# Altium schematic sheet FPGA.SchDoc
size A1; Organization: Altium Limited; Address1: L3, 12a Rodborough Rd; Address2: Frenchs Forest; Address3: NSW; Address4: Australia 2086
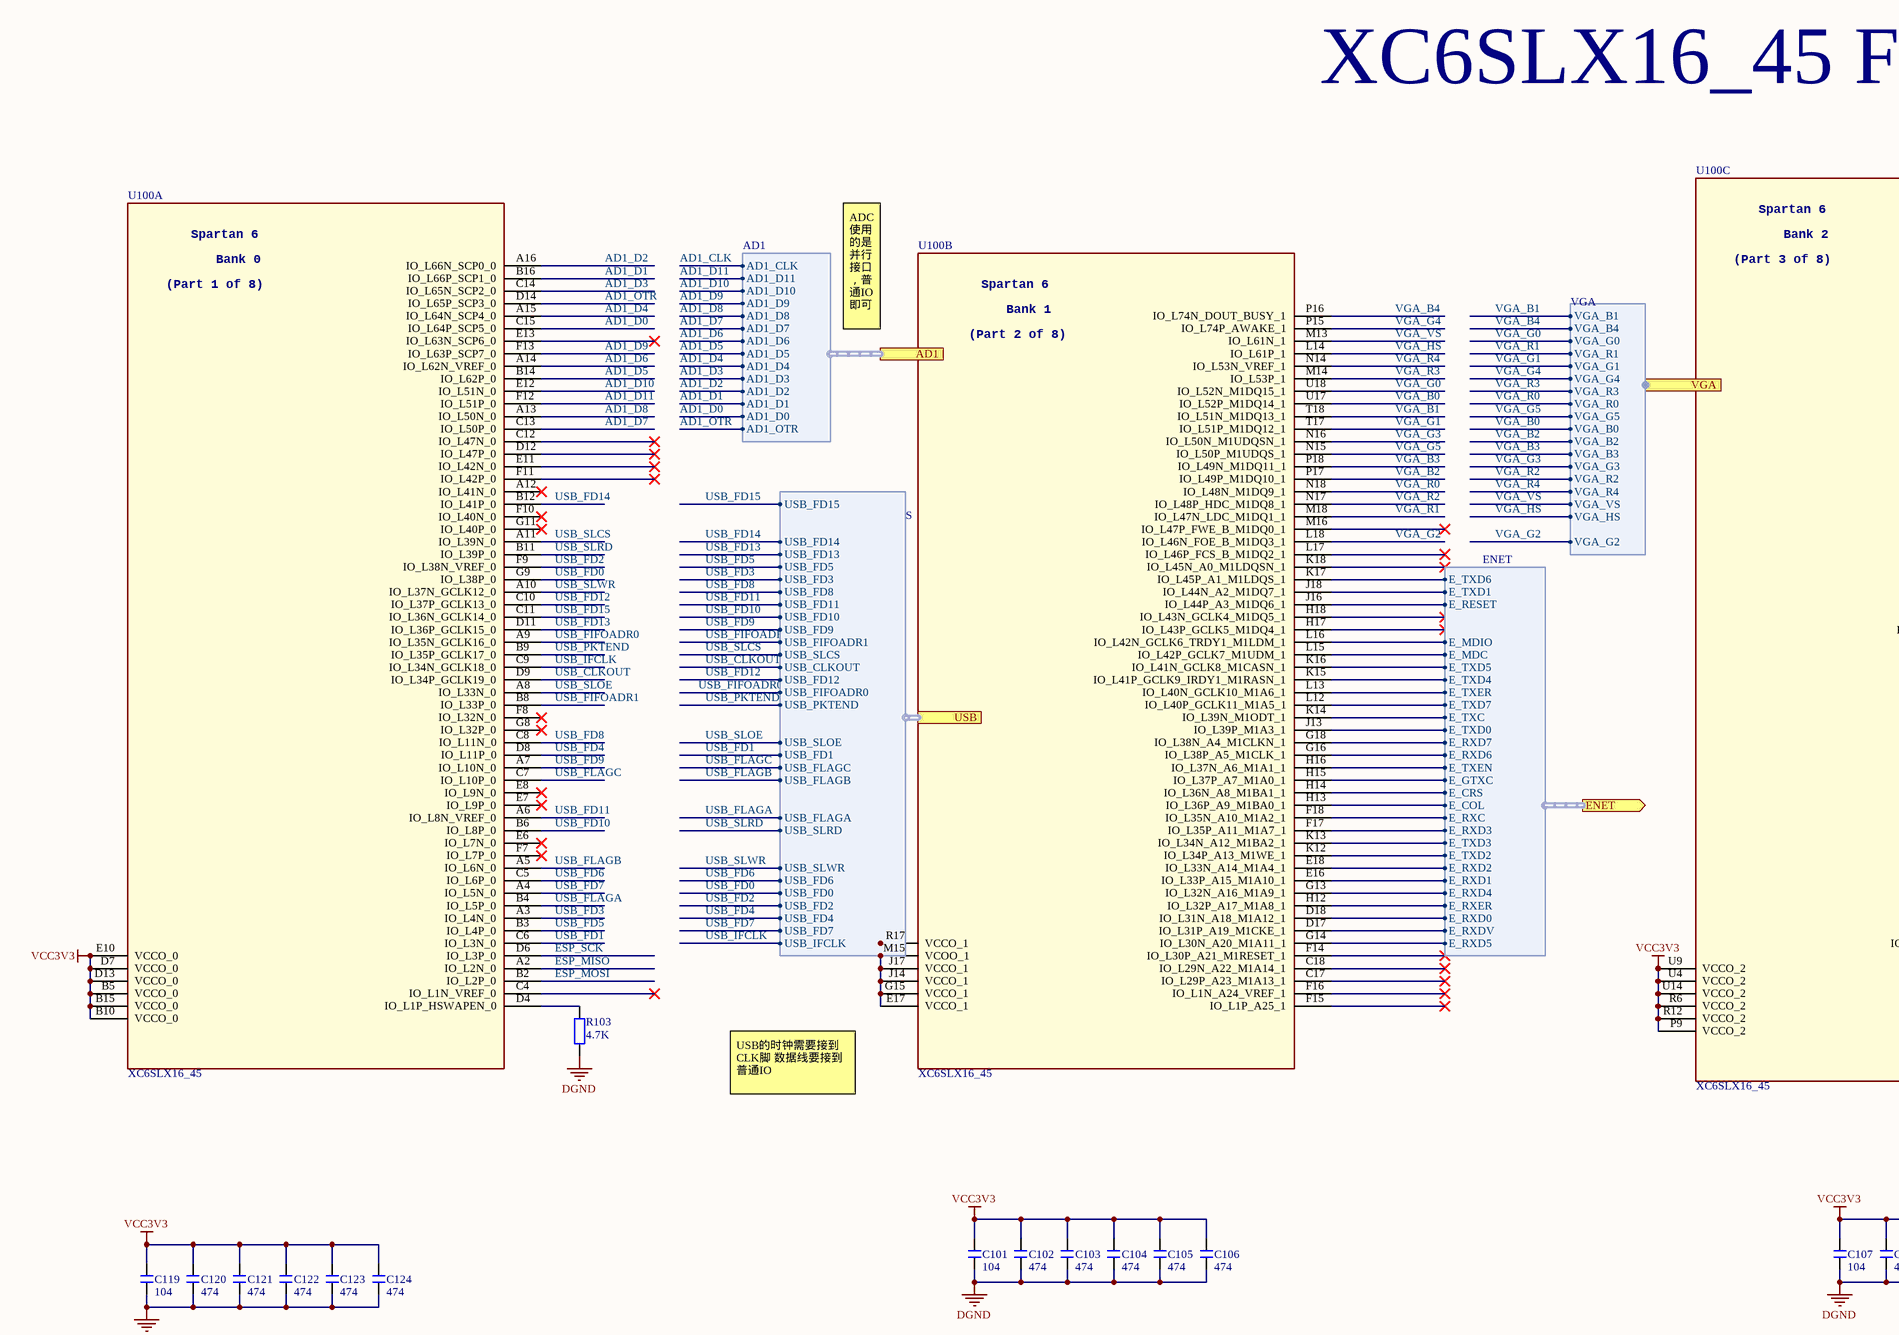
[diagram p0: FPGA.SchDoc, top left]
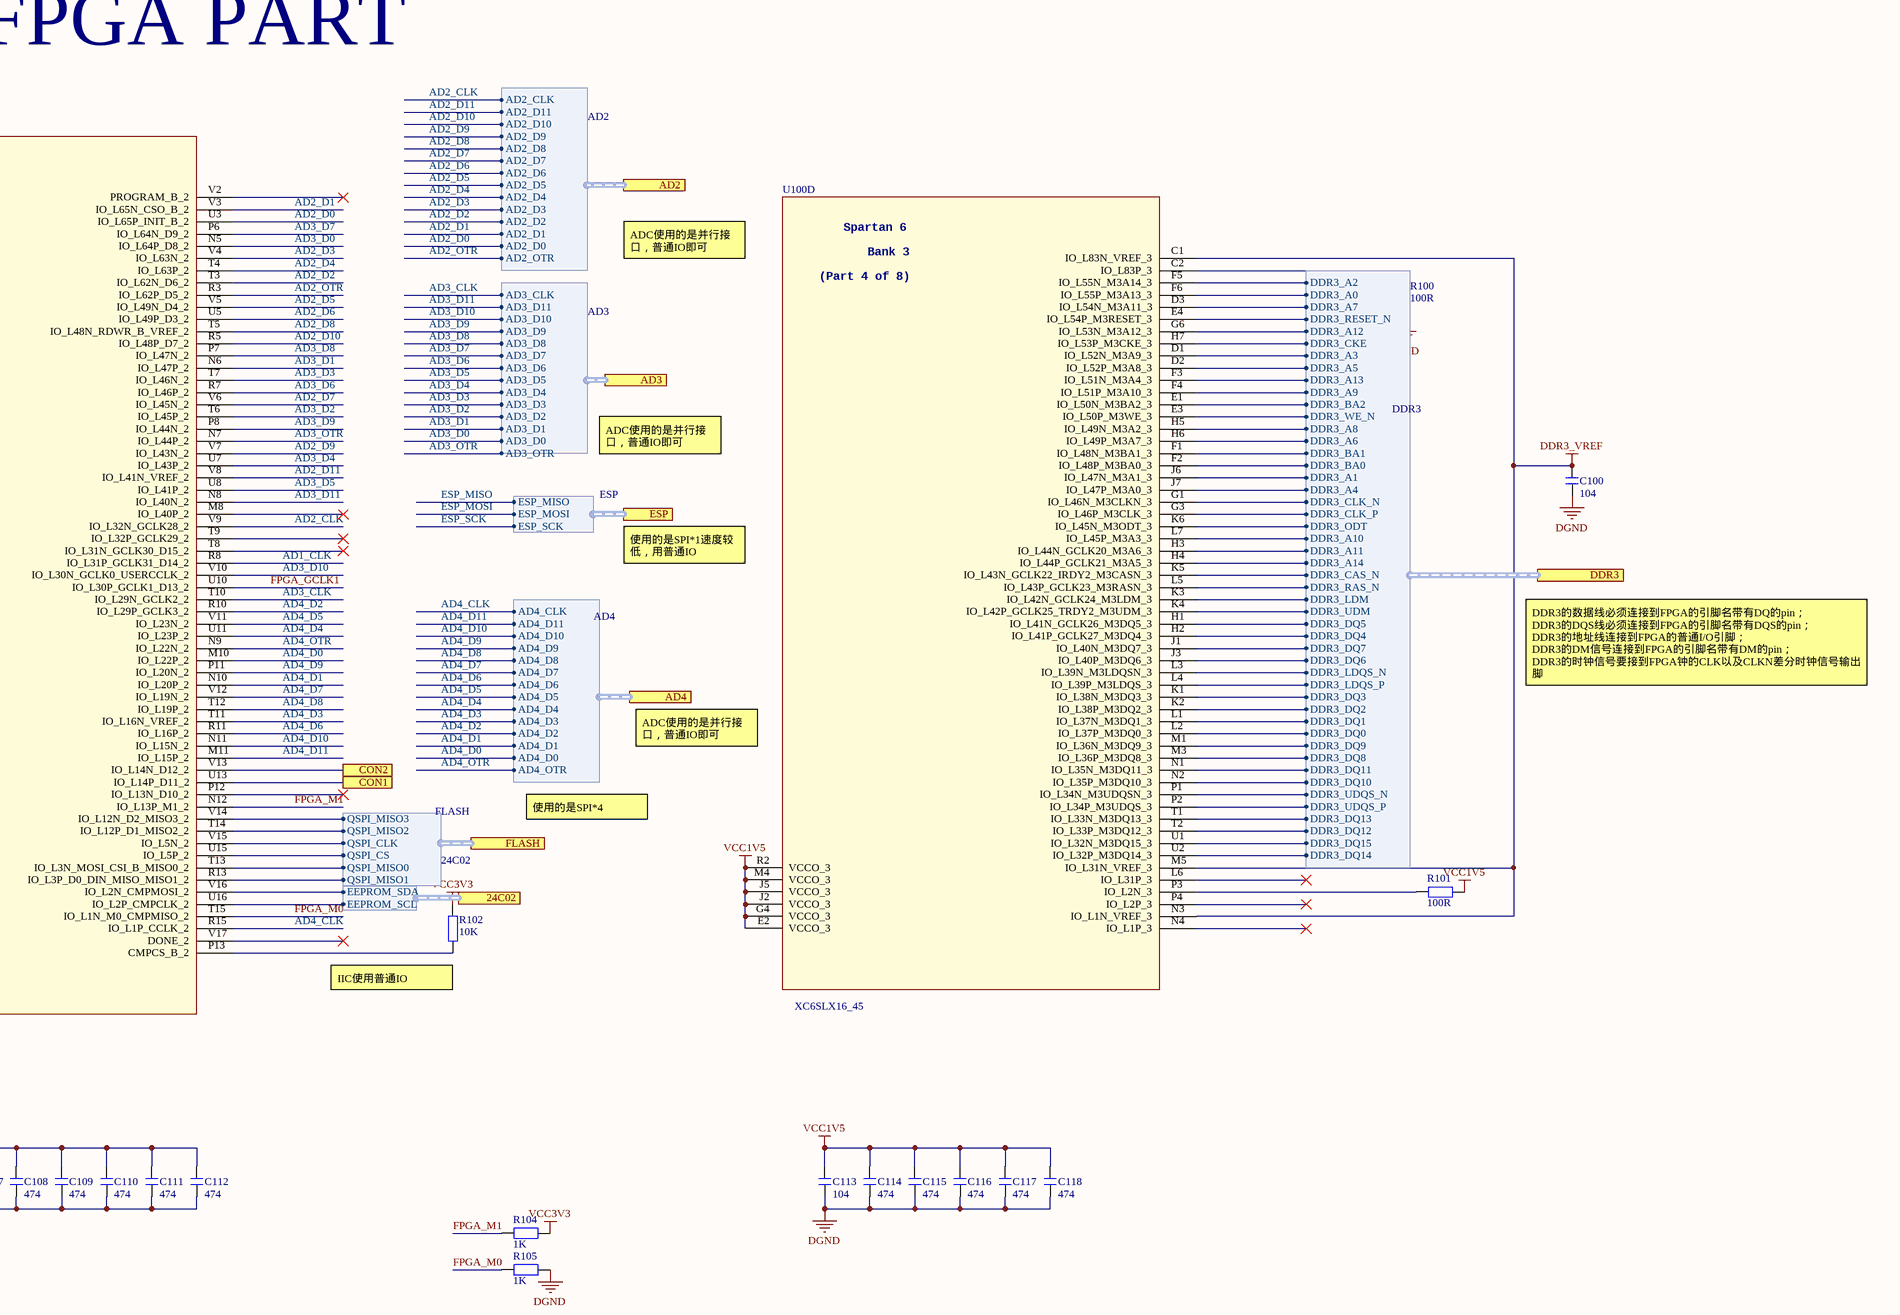
[diagram p1: FPGA.SchDoc, top right]
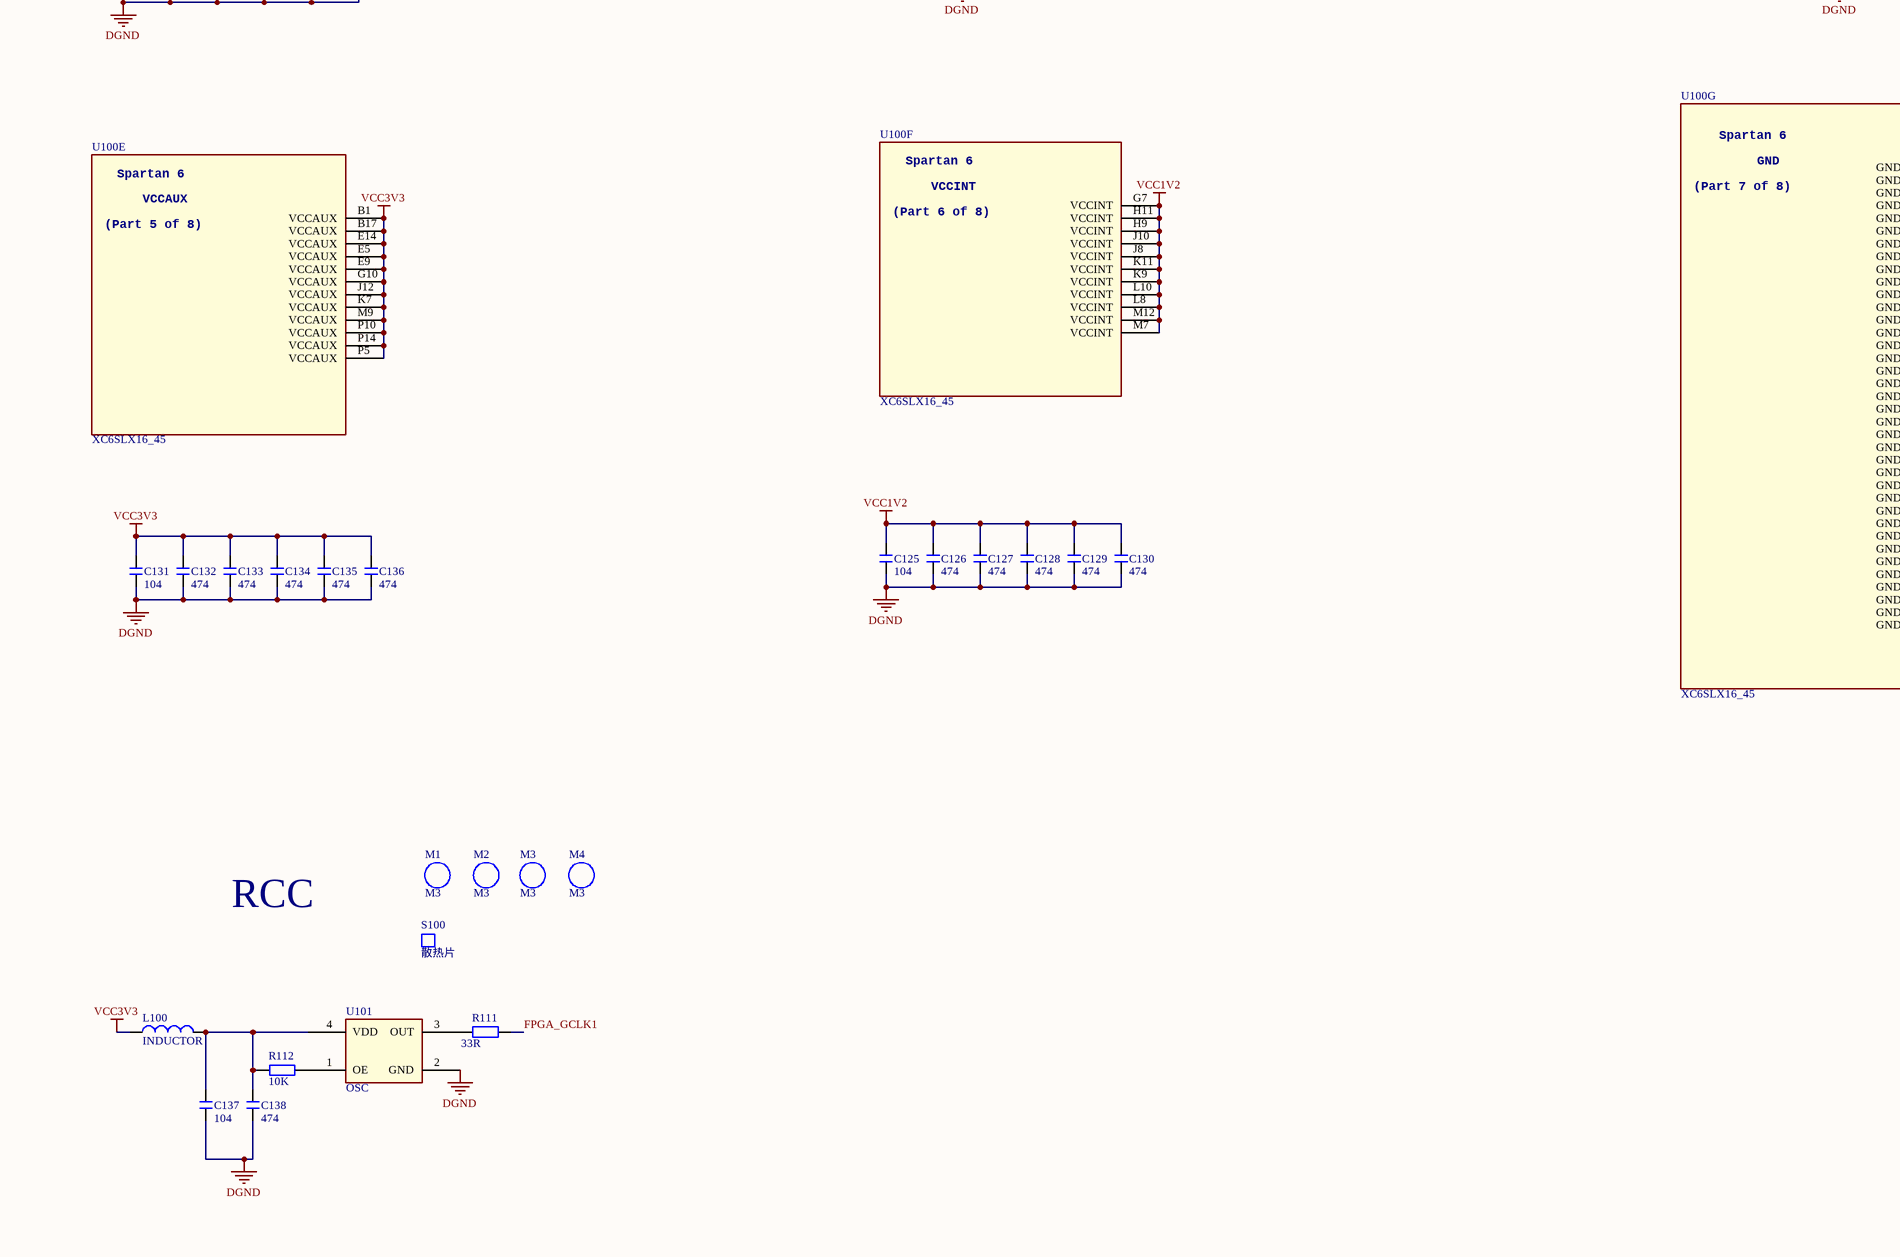
[diagram p2: FPGA.SchDoc, bottom left]
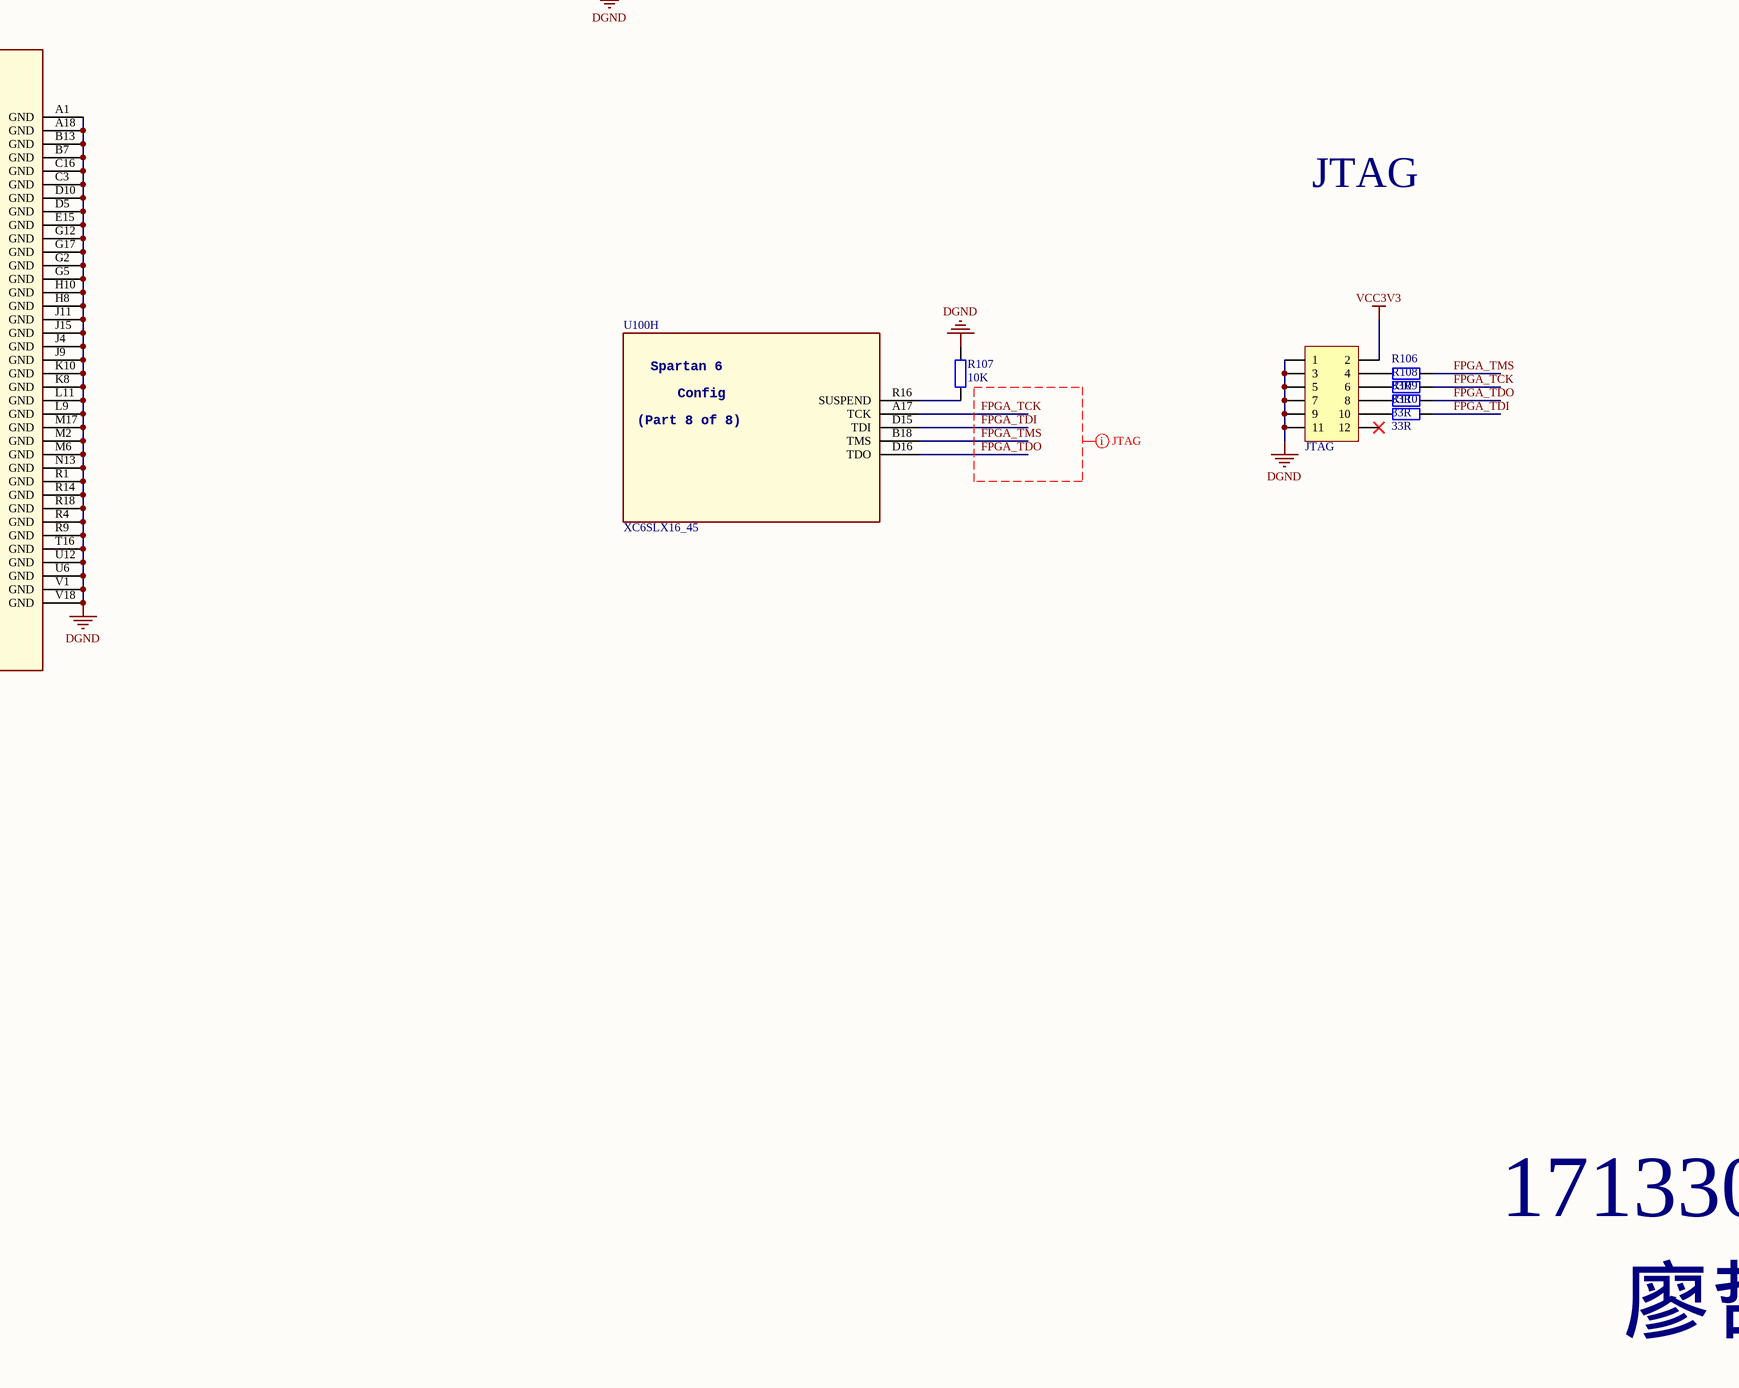
[diagram p3: FPGA.SchDoc, bottom right]

## Parts
C100  104  [C 0402_M]
C101  104  [C 0402_M]
C102  474  [C 0402_M]
C103  474  [C 0402_M]
C104  474  [C 0402_M]
C105  474  [C 0402_M]
C106  474  [C 0402_M]
C107  104  [C 0402_M]
C108  474  [C 0402_M]
C109  474  [C 0402_M]
C110  474  [C 0402_M]
C111  474  [C 0402_M]
C112  474  [C 0402_M]
C113  104  [C 0402_M]
C114  474  [C 0402_M]
C115  474  [C 0402_M]
C116  474  [C 0402_M]
C117  474  [C 0402_M]
C118  474  [C 0402_M]
C119  104  [C 0402_M]
C120  474  [C 0402_M]
C121  474  [C 0402_M]
C122  474  [C 0402_M]
C123  474  [C 0402_M]
C124  474  [C 0402_M]
C125  104  [C 0402_M]
C126  474  [C 0402_M]
C127  474  [C 0402_M]
C128  474  [C 0402_M]
C129  474  [C 0402_M]
C130  474  [C 0402_M]
C131  104  [C 0402_M]
C132  474  [C 0402_M]
C133  474  [C 0402_M]
C134  474  [C 0402_M]
C135  474  [C 0402_M]
C136  474  [C 0402_M]
C137  104  [C 0402_M]
C138  474  [C 0402_M]
JTAG  Header 6X2  [IDC2.54-LI-2x6P]  (value not drawn)
L100  INDUCTOR  [L 0805]
M1  M3  [M3 140X350]
M2  M3  [M3 140X350]
M3  M3  [M3 140X350]
M4  M3  [M3 140X350]
R100  100R  [R 0402_M]
R101  100R  [R 0402_M]
R102  10K  [R 0402_M]
R103  4.7K  [R 0402_M]
R104  1K  [R 0402_M]
R105  1K  [R 0402_M]
R106  33R  [R 0402_M]
R107  10K  [R 0402_M]
R108  33R  [R 0402_M]
R109  33R  [R 0402_M]
R110  33R  [R 0402_M]
R111  33R  [R 0402_M]
R112  10K  [R 0402_M]
S100  散热片  [SRP10-15-21]
U100  XC6SLX16_45  [BGA324C80P18X18_1500X1500X150]  (parts A,B,C,D,E,F,G,H of 8)
U101  OSC  [OSC 8045-4P]

## Ports
24C02 (harness 24C02), AD1 (harness AD1), AD2 (harness AD2), AD3 (harness AD3), AD4 (harness AD4), CON1, CON2, DDR3 (harness DDR3), ENET (out, harness ENET), ESP (harness ESP), FLASH (harness FLASH), USB (harness S), VGA (harness VGA)

## Harnesses
DDR3: DDR3_A2, DDR3_A0, DDR3_A7, DDR3_RESET_N, DDR3_A12, DDR3_CKE, DDR3_A3, DDR3_A5, DDR3_A13, DDR3_A9, DDR3_BA2, DDR3_WE_N, DDR3_A8, DDR3_A6, DDR3_BA1, DDR3_BA0, DDR3_A1, DDR3_A4, DDR3_CLK_N, DDR3_CLK_P, DDR3_ODT, DDR3_A10, DDR3_A11, DDR3_A14, DDR3_CAS_N, DDR3_RAS_N, DDR3_LDM, DDR3_UDM, DDR3_DQ5, DDR3_DQ4, DDR3_DQ7, DDR3_DQ6, DDR3_LDQS_N, DDR3_LDQS_P, DDR3_DQ3, DDR3_DQ2, DDR3_DQ1, DDR3_DQ0, DDR3_DQ9, DDR3_DQ8, DDR3_DQ11, DDR3_DQ10, DDR3_UDQS_N, DDR3_UDQS_P, DDR3_DQ13, DDR3_DQ12, DDR3_DQ15, DDR3_DQ14
ENET: E_TXD6, E_TXD1, E_RESET, E_MDIO, E_MDC, E_TXD5, E_TXD4, E_TXER, E_TXD7, E_TXC, E_TXD0, E_RXD7, E_RXD6, E_TXEN, E_GTXC, E_CRS, E_COL, E_RXC, E_RXD3, E_TXD3, E_TXD2, E_RXD2, E_RXD1, E_RXD4, E_RXER, E_RXD0, E_RXDV, E_RXD5
FLASH: QSPI_MISO3, QSPI_MISO2, QSPI_CLK, QSPI_CS, QSPI_MISO0, QSPI_MISO1
AD1: AD1_CLK, AD1_D11, AD1_D10, AD1_D9, AD1_D8, AD1_D7, AD1_D6, AD1_D5, AD1_D4, AD1_D3, AD1_D2, AD1_D1, AD1_D0, AD1_OTR
AD2: AD2_CLK, AD2_D11, AD2_D10, AD2_D9, AD2_D8, AD2_D7, AD2_D6, AD2_D5, AD2_D4, AD2_D3, AD2_D2, AD2_D1, AD2_D0, AD2_OTR
AD3: AD3_CLK, AD3_D11, AD3_D10, AD3_D9, AD3_D8, AD3_D7, AD3_D6, AD3_D5, AD3_D4, AD3_D3, AD3_D2, AD3_D1, AD3_D0, AD3_OTR
AD4: AD4_CLK, AD4_D11, AD4_D10, AD4_D9, AD4_D8, AD4_D7, AD4_D6, AD4_D5, AD4_D4, AD4_D3, AD4_D2, AD4_D1, AD4_D0, AD4_OTR
ESP: ESP_MISO, ESP_MOSI, ESP_SCK
VGA: VGA_B1, VGA_B4, VGA_G0, VGA_R1, VGA_G1, VGA_G4, VGA_R3, VGA_R0, VGA_G5, VGA_B0, VGA_G3, VGA_R2, VGA_G2, VGA_R4, VGA_VS, VGA_HS, VGA_B2, VGA_B3
S: USB_FD15, USB_FD14, USB_FD13, USB_FD5, USB_FD3, USB_FD8, USB_FD11, USB_FD10, USB_FD9, USB_FIFOADR1, USB_SLCS, USB_CLKOUT, USB_FD12, USB_FIFOADR0, USB_PKTEND, USB_SLOE, USB_FD1, USB_FLAGC, USB_FLAGB, USB_FLAGA, USB_SLRD, USB_SLWR, USB_FD6, USB_FD0, USB_FD2, USB_FD4, USB_FD7, USB_IFCLK
24C02: EEPROM_SDA, EEPROM_SCL

## Nets
DDR3_VREF: C100.2 U100.C1(IO_L83N_VREF_3) U100.M5(IO_L31N_VREF_3) U100.N3(IO_L1N_VREF_3)
DGND: C100.1 C101.1 C102.1 C103.1 C104.1 C105.1 C106.1 C107.1 C108.1 C109.1 C110.1 C111.1 C112.1 C113.1 C114.1 C115.1 C116.1 C117.1 C118.1 C119.1 C120.1 C121.1 C122.1 C123.1 C124.1 C125.1 C126.1 C127.1 C128.1 C129.1 C130.1 C131.1 C132.1 C133.1 C134.1 C135.1 C136.1 C137.1 C138.1 JTAG.1 JTAG.3 JTAG.5 JTAG.7 JTAG.9 JTAG.11 R100.1 R103.1 R105.2 R107.1 U100.A1(GND) U100.A18(GND) U100.B7(GND) U100.B13(GND) U100.C3(GND) U100.C16(GND) U100.D5(GND) U100.D10(GND) U100.E15(GND) U100.G2(GND) U100.G5(GND) U100.G12(GND) U100.G17(GND) U100.H8(GND) U100.H10(GND) U100.J4(GND) U100.J9(GND) U100.J11(GND) U100.J15(GND) U100.K8(GND) U100.K10(GND) U100.L9(GND) U100.L11(GND) U100.M2(GND) U100.M6(GND) U100.M17(GND) U100.N13(GND) U100.R1(GND) U100.R4(GND) U100.R9(GND) U100.R14(GND) U100.R18(GND) U100.T16(GND) U100.U6(GND) U100.U12(GND) U100.V1(GND) U100.V18(GND) U101.2(GND)
VCC1V2: C125.2 C126.2 C127.2 C128.2 C129.2 C130.2 U100.G7(VCCINT) U100.H9(VCCINT) U100.H11(VCCINT) U100.J8(VCCINT) U100.J10(VCCINT) U100.K9(VCCINT) U100.K11(VCCINT) U100.L8(VCCINT) U100.L10(VCCINT) U100.M7(VCCINT) U100.M12(VCCINT)
VCC1V5: C113.2 C114.2 C115.2 C116.2 C117.2 C118.2 R101.1 U100.E2(VCCO_3) U100.G4(VCCO_3) U100.J2(VCCO_3) U100.J5(VCCO_3) U100.M4(VCCO_3) U100.R2(VCCO_3)
VCC3V3: C101.2 C102.2 C103.2 C104.2 C105.2 C106.2 C107.2 C108.2 C109.2 C110.2 C111.2 C112.2 C119.2 C120.2 C121.2 C122.2 C123.2 C124.2 C131.2 C132.2 C133.2 C134.2 C135.2 C136.2 JTAG.2 L100.1 R102.1 R104.2 U100.B1(VCCAUX) U100.B5(VCCO_0) U100.B10(VCCO_0) U100.B15(VCCO_0) U100.B17(VCCAUX) U100.D7(VCCO_0) U100.D13(VCCO_0) U100.E5(VCCAUX) U100.E9(VCCAUX) U100.E10(VCCO_0) U100.E14(VCCAUX) U100.E17(VCCO_1) U100.G10(VCCAUX) U100.G15(VCCO_1) U100.J12(VCCAUX) U100.J14(VCCO_1) U100.J17(VCCO_1) U100.K7(VCCAUX) U100.M9(VCCAUX) U100.M15(VCOO_1) U100.P5(VCCAUX) U100.P9(VCCO_2) U100.P10(VCCAUX) U100.P14(VCCAUX) U100.R6(VCCO_2) U100.R12(VCCO_2) U100.R17(VCCO_1) U100.U4(VCCO_2) U100.U9(VCCO_2) U100.U14(VCCO_2)
AD1_CLK: U100.R8(IO_L31P_GCLK31_D14_2) ; port AD1.AD1_CLK
AD1_D0: U100.C15(IO_L64P_SCP5_0) ; port AD1.AD1_D0
AD1_D1: U100.B16(IO_L66P_SCP1_0) ; port AD1.AD1_D1
AD1_D2: U100.A16(IO_L66N_SCP0_0) ; port AD1.AD1_D2
AD1_D3: U100.C14(IO_L65N_SCP2_0) ; port AD1.AD1_D3
AD1_D4: U100.A15(IO_L64N_SCP4_0) ; port AD1.AD1_D4
AD1_D5: U100.B14(IO_L62P_0) ; port AD1.AD1_D5
AD1_D6: U100.A14(IO_L62N_VREF_0) ; port AD1.AD1_D6
AD1_D7: U100.C13(IO_L50P_0) ; port AD1.AD1_D7
AD1_D8: U100.A13(IO_L50N_0) ; port AD1.AD1_D8
AD1_D9: U100.F13(IO_L63P_SCP7_0) ; port AD1.AD1_D9
AD1_D10: U100.E12(IO_L51N_0) ; port AD1.AD1_D10
AD1_D11: U100.F12(IO_L51P_0) ; port AD1.AD1_D11
AD1_OTR: U100.D14(IO_L65P_SCP3_0) ; port AD1.AD1_OTR
AD2_CLK: U100.V9(IO_L32N_GCLK28_2) ; port AD2.AD2_CLK
AD2_D0: U100.U3(IO_L65P_INIT_B_2) ; port AD2.AD2_D0
AD2_D1: U100.V3(IO_L65N_CSO_B_2) ; port AD2.AD2_D1
AD2_D2: U100.T3(IO_L62N_D6_2) ; port AD2.AD2_D2
AD2_D3: U100.V4(IO_L63N_2) ; port AD2.AD2_D3
AD2_D4: U100.T4(IO_L63P_2) ; port AD2.AD2_D4
AD2_D5: U100.V5(IO_L49N_D4_2) ; port AD2.AD2_D5
AD2_D6: U100.U5(IO_L49P_D3_2) ; port AD2.AD2_D6
AD2_D7: U100.V6(IO_L45N_2) ; port AD2.AD2_D7
AD2_D8: U100.T5(IO_L48N_RDWR_B_VREF_2) ; port AD2.AD2_D8
AD2_D9: U100.V7(IO_L43N_2) ; port AD2.AD2_D9
AD2_D10: U100.R5(IO_L48P_D7_2) ; port AD2.AD2_D10
AD2_D11: U100.V8(IO_L41N_VREF_2) ; port AD2.AD2_D11
AD2_OTR: U100.R3(IO_L62P_D5_2) ; port AD2.AD2_OTR
AD3_CLK: U100.T10(IO_L29N_GCLK2_2) ; port AD3.AD3_CLK
AD3_D0: U100.N5(IO_L64P_D8_2) ; port AD3.AD3_D0
AD3_D1: U100.N6(IO_L47P_2) ; port AD3.AD3_D1
AD3_D2: U100.T6(IO_L45P_2) ; port AD3.AD3_D2
AD3_D3: U100.T7(IO_L46N_2) ; port AD3.AD3_D3
AD3_D4: U100.U7(IO_L43P_2) ; port AD3.AD3_D4
AD3_D5: U100.U8(IO_L41P_2) ; port AD3.AD3_D5
AD3_D6: U100.R7(IO_L46P_2) ; port AD3.AD3_D6
AD3_D7: U100.P6(IO_L64N_D9_2) ; port AD3.AD3_D7
AD3_D8: U100.P7(IO_L47N_2) ; port AD3.AD3_D8
AD3_D9: U100.P8(IO_L44N_2) ; port AD3.AD3_D9
AD3_D10: U100.V10(IO_L30N_GCLK0_USERCCLK_2) ; port AD3.AD3_D10
AD3_D11: U100.N8(IO_L40N_2) ; port AD3.AD3_D11
AD3_OTR: U100.N7(IO_L44P_2) ; port AD3.AD3_OTR
AD4_CLK: U100.R15(IO_L1P_CCLK_2) ; port AD4.AD4_CLK
AD4_D0: U100.M10(IO_L22P_2) ; port AD4.AD4_D0
AD4_D1: U100.N10(IO_L20P_2) ; port AD4.AD4_D1
AD4_D2: U100.R10(IO_L29P_GCLK3_2) ; port AD4.AD4_D2
AD4_D3: U100.T11(IO_L16N_VREF_2) ; port AD4.AD4_D3
AD4_D4: U100.U11(IO_L23P_2) ; port AD4.AD4_D4
AD4_D5: U100.V11(IO_L23N_2) ; port AD4.AD4_D5
AD4_D6: U100.R11(IO_L16P_2) ; port AD4.AD4_D6
AD4_D7: U100.V12(IO_L19N_2) ; port AD4.AD4_D7
AD4_D8: U100.T12(IO_L19P_2) ; port AD4.AD4_D8
AD4_D9: U100.P11(IO_L20N_2) ; port AD4.AD4_D9
AD4_D10: U100.N11(IO_L15N_2) ; port AD4.AD4_D10
AD4_D11: U100.M11(IO_L15P_2) ; port AD4.AD4_D11
AD4_OTR: U100.N9(IO_L22N_2) ; port AD4.AD4_OTR
CON1: U100.U13(IO_L14P_D11_2) ; port CON1
CON2: U100.V13(IO_L14N_D12_2) ; port CON2
ESP_MISO: U100.A2(IO_L2N_0) ; port ESP.ESP_MISO
ESP_MOSI: U100.B2(IO_L2P_0) ; port ESP.ESP_MOSI
ESP_SCK: U100.D6(IO_L3P_0) ; port ESP.ESP_SCK
FPGA_GCLK1: R111.2 U100.U10(IO_L30P_GCLK1_D13_2)
FPGA_M0: R105.1 U100.T15(IO_L1N_M0_CMPMISO_2)
FPGA_M1: R104.1 U100.N12(IO_L13P_M1_2)
FPGA_TCK: R108.2 U100.A17(TCK)
FPGA_TDI: R110.2 U100.D15(TDI)
FPGA_TDO: R109.2 U100.D16(TDO)
FPGA_TMS: R106.2 U100.B18(TMS)
USB_CLKOUT: U100.D9(IO_L34P_GCLK19_0) ; port USB.USB_CLKOUT
USB_FD0: U100.G9(IO_L38P_0) ; port USB.USB_FD0
USB_FD1: U100.C6(IO_L3N_0) ; port USB.USB_FD1
USB_FD2: U100.F9(IO_L38N_VREF_0) ; port USB.USB_FD2
USB_FD3: U100.A3(IO_L4N_0) ; port USB.USB_FD3
USB_FD4: U100.D8(IO_L11P_0) ; port USB.USB_FD4
USB_FD5: U100.B3(IO_L4P_0) ; port USB.USB_FD5
USB_FD6: U100.C5(IO_L6P_0) ; port USB.USB_FD6
USB_FD7: U100.A4(IO_L5N_0) ; port USB.USB_FD7
USB_FD8: U100.C8(IO_L11N_0) ; port USB.USB_FD8
USB_FD9: U100.A7(IO_L10N_0) ; port USB.USB_FD9
USB_FD10: U100.B6(IO_L8P_0) ; port USB.USB_FD10
USB_FD11: U100.A6(IO_L8N_VREF_0) ; port USB.USB_FD11
USB_FD12: U100.C10(IO_L37P_GCLK13_0) ; port USB.USB_FD12
USB_FD13: U100.D11(IO_L36P_GCLK15_0) ; port USB.USB_FD13
USB_FD14: U100.B12(IO_L41P_0) ; port USB.USB_FD14
USB_FD15: U100.C11(IO_L36N_GCLK14_0) ; port USB.USB_FD15
USB_FIFOADR0: U100.A9(IO_L35N_GCLK16_0) ; port USB.USB_FIFOADR0
USB_FIFOADR1: U100.B8(IO_L33P_0) ; port USB.USB_FIFOADR1
USB_FLAGA: U100.B4(IO_L5P_0) ; port USB.USB_FLAGA
USB_FLAGB: U100.A5(IO_L6N_0) ; port USB.USB_FLAGB
USB_FLAGC: U100.C7(IO_L10P_0) ; port USB.USB_FLAGC
USB_IFCLK: U100.C9(IO_L34N_GCLK18_0) ; port USB.USB_IFCLK
USB_PKTEND: U100.B9(IO_L35P_GCLK17_0) ; port USB.USB_PKTEND
USB_SLCS: U100.A11(IO_L39N_0) ; port USB.USB_SLCS
USB_SLOE: U100.A8(IO_L33N_0) ; port USB.USB_SLOE
USB_SLRD: U100.B11(IO_L39P_0) ; port USB.USB_SLRD
USB_SLWR: U100.A10(IO_L37N_GCLK12_0) ; port USB.USB_SLWR
VGA_B0: U100.U17(IO_L52P_M1DQ14_1) ; port VGA.VGA_B0
VGA_B1: U100.T18(IO_L51N_M1DQ13_1) ; port VGA.VGA_B1
VGA_B2: U100.P17(IO_L49P_M1DQ10_1) ; port VGA.VGA_B2
VGA_B3: U100.P18(IO_L49N_M1DQ11_1) ; port VGA.VGA_B3
VGA_B4: U100.P16(IO_L74N_DOUT_BUSY_1) ; port VGA.VGA_B4
VGA_G0: U100.U18(IO_L52N_M1DQ15_1) ; port VGA.VGA_G0
VGA_G1: U100.T17(IO_L51P_M1DQ12_1) ; port VGA.VGA_G1
VGA_G2: U100.L18(IO_L46N_FOE_B_M1DQ3_1) ; port VGA.VGA_G2
VGA_G3: U100.N16(IO_L50N_M1UDQSN_1) ; port VGA.VGA_G3
VGA_G4: U100.P15(IO_L74P_AWAKE_1) ; port VGA.VGA_G4
VGA_G5: U100.N15(IO_L50P_M1UDQS_1) ; port VGA.VGA_G5
VGA_HS: U100.L14(IO_L61P_1) ; port VGA.VGA_HS
VGA_R0: U100.N18(IO_L48N_M1DQ9_1) ; port VGA.VGA_R0
VGA_R1: U100.M18(IO_L47N_LDC_M1DQ1_1) ; port VGA.VGA_R1
VGA_R2: U100.N17(IO_L48P_HDC_M1DQ8_1) ; port VGA.VGA_R2
VGA_R3: U100.M14(IO_L53P_1) ; port VGA.VGA_R3
VGA_R4: U100.N14(IO_L53N_VREF_1) ; port VGA.VGA_R4
VGA_VS: U100.M13(IO_L61N_1) ; port VGA.VGA_VS
NetC137_2: C137.2 C138.2 L100.2 R112.1 U101.4(VDD)
NetJTAG_4: JTAG.4 R106.1
NetJTAG_6: JTAG.6 R108.1
NetJTAG_8: JTAG.8 R109.1
NetJTAG_10: JTAG.10 R110.1
NetR100_2: R100.2 U100.C2(IO_L83P_3)
NetR101_2: R101.2 U100.P3(IO_L2N_3)
NetR102_2: R102.2 U100.P13(CMPCS_B_2)
NetR103_2: R103.2 U100.D4(IO_L1P_HSWAPEN_0)
NetR107_2: R107.2 U100.R16(SUSPEND)
NetR111_1: R111.1 U101.3(OUT)
NetR112_2: R112.2 U101.1(OE)
NetU100_D1: U100.D1(IO_L52N_M3A9_3) ; port DDR3.DDR3_A3
NetU100_D2: U100.D2(IO_L52P_M3A8_3) ; port DDR3.DDR3_A5
NetU100_D3: U100.D3(IO_L54N_M3A11_3) ; port DDR3.DDR3_A7
NetU100_D17: U100.D17(IO_L31P_A19_M1CKE_1) ; port ENET.E_RXDV
NetU100_D18: U100.D18(IO_L31N_A18_M1A12_1) ; port ENET.E_RXD0
NetU100_E1: U100.E1(IO_L50N_M3BA2_3) ; port DDR3.DDR3_BA2
NetU100_E3: U100.E3(IO_L50P_M3WE_3) ; port DDR3.DDR3_WE_N
NetU100_E4: U100.E4(IO_L54P_M3RESET_3) ; port DDR3.DDR3_RESET_N
NetU100_E16: U100.E16(IO_L33P_A15_M1A10_1) ; port ENET.E_RXD1
NetU100_E18: U100.E18(IO_L33N_A14_M1A4_1) ; port ENET.E_RXD2
NetU100_F1: U100.F1(IO_L48N_M3BA1_3) ; port DDR3.DDR3_BA1
NetU100_F2: U100.F2(IO_L48P_M3BA0_3) ; port DDR3.DDR3_BA0
NetU100_F3: U100.F3(IO_L51N_M3A4_3) ; port DDR3.DDR3_A13
NetU100_F4: U100.F4(IO_L51P_M3A10_3) ; port DDR3.DDR3_A9
NetU100_F5: U100.F5(IO_L55N_M3A14_3) ; port DDR3.DDR3_A2
NetU100_F6: U100.F6(IO_L55P_M3A13_3) ; port DDR3.DDR3_A0
NetU100_F17: U100.F17(IO_L35P_A11_M1A7_1) ; port ENET.E_RXD3
NetU100_F18: U100.F18(IO_L35N_A10_M1A2_1) ; port ENET.E_RXC
NetU100_G1: U100.G1(IO_L46N_M3CLKN_3) ; port DDR3.DDR3_CLK_N
NetU100_G3: U100.G3(IO_L46P_M3CLK_3) ; port DDR3.DDR3_CLK_P
NetU100_G6: U100.G6(IO_L53N_M3A12_3) ; port DDR3.DDR3_A12
NetU100_G13: U100.G13(IO_L32N_A16_M1A9_1) ; port ENET.E_RXD4
NetU100_G14: U100.G14(IO_L30N_A20_M1A11_1) ; port ENET.E_RXD5
NetU100_G16: U100.G16(IO_L38P_A5_M1CLK_1) ; port ENET.E_RXD6
NetU100_G18: U100.G18(IO_L38N_A4_M1CLKN_1) ; port ENET.E_RXD7
NetU100_H1: U100.H1(IO_L41N_GCLK26_M3DQ5_3) ; port DDR3.DDR3_DQ5
NetU100_H2: U100.H2(IO_L41P_GCLK27_M3DQ4_3) ; port DDR3.DDR3_DQ4
NetU100_H3: U100.H3(IO_L44N_GCLK20_M3A6_3) ; port DDR3.DDR3_A11
NetU100_H4: U100.H4(IO_L44P_GCLK21_M3A5_3) ; port DDR3.DDR3_A14
NetU100_H5: U100.H5(IO_L49N_M3A2_3) ; port DDR3.DDR3_A8
NetU100_H6: U100.H6(IO_L49P_M3A7_3) ; port DDR3.DDR3_A6
NetU100_H7: U100.H7(IO_L53P_M3CKE_3) ; port DDR3.DDR3_CKE
NetU100_H12: U100.H12(IO_L32P_A17_M1A8_1) ; port ENET.E_RXER
NetU100_H13: U100.H13(IO_L36P_A9_M1BA0_1) ; port ENET.E_COL
NetU100_H14: U100.H14(IO_L36N_A8_M1BA1_1) ; port ENET.E_CRS
NetU100_H15: U100.H15(IO_L37P_A7_M1A0_1) ; port ENET.E_GTXC
NetU100_H16: U100.H16(IO_L37N_A6_M1A1_1) ; port ENET.E_TXEN
NetU100_J1: U100.J1(IO_L40N_M3DQ7_3) ; port DDR3.DDR3_DQ7
NetU100_J3: U100.J3(IO_L40P_M3DQ6_3) ; port DDR3.DDR3_DQ6
NetU100_J6: U100.J6(IO_L47N_M3A1_3) ; port DDR3.DDR3_A1
NetU100_J7: U100.J7(IO_L47P_M3A0_3) ; port DDR3.DDR3_A4
NetU100_J13: U100.J13(IO_L39P_M1A3_1) ; port ENET.E_TXD0
NetU100_J16: U100.J16(IO_L44P_A3_M1DQ6_1) ; port ENET.E_RESET
NetU100_J18: U100.J18(IO_L44N_A2_M1DQ7_1) ; port ENET.E_TXD1
NetU100_K1: U100.K1(IO_L38N_M3DQ3_3) ; port DDR3.DDR3_DQ3
NetU100_K2: U100.K2(IO_L38P_M3DQ2_3) ; port DDR3.DDR3_DQ2
NetU100_K3: U100.K3(IO_L42N_GCLK24_M3LDM_3) ; port DDR3.DDR3_LDM
NetU100_K4: U100.K4(IO_L42P_GCLK25_TRDY2_M3UDM_3) ; port DDR3.DDR3_UDM
NetU100_K5: U100.K5(IO_L43N_GCLK22_IRDY2_M3CASN_3) ; port DDR3.DDR3_CAS_N
NetU100_K6: U100.K6(IO_L45N_M3ODT_3) ; port DDR3.DDR3_ODT
NetU100_K12: U100.K12(IO_L34P_A13_M1WE_1) ; port ENET.E_TXD2
NetU100_K13: U100.K13(IO_L34N_A12_M1BA2_1) ; port ENET.E_TXD3
NetU100_K14: U100.K14(IO_L39N_M1ODT_1) ; port ENET.E_TXC
NetU100_K15: U100.K15(IO_L41P_GCLK9_IRDY1_M1RASN_1) ; port ENET.E_TXD4
NetU100_K16: U100.K16(IO_L41N_GCLK8_M1CASN_1) ; port ENET.E_TXD5
NetU100_K17: U100.K17(IO_L45P_A1_M1LDQS_1) ; port ENET.E_TXD6
NetU100_L1: U100.L1(IO_L37N_M3DQ1_3) ; port DDR3.DDR3_DQ1
NetU100_L2: U100.L2(IO_L37P_M3DQ0_3) ; port DDR3.DDR3_DQ0
NetU100_L3: U100.L3(IO_L39N_M3LDQSN_3) ; port DDR3.DDR3_LDQS_N
NetU100_L4: U100.L4(IO_L39P_M3LDQS_3) ; port DDR3.DDR3_LDQS_P
NetU100_L5: U100.L5(IO_L43P_GCLK23_M3RASN_3) ; port DDR3.DDR3_RAS_N
NetU100_L7: U100.L7(IO_L45P_M3A3_3) ; port DDR3.DDR3_A10
NetU100_L12: U100.L12(IO_L40P_GCLK11_M1A5_1) ; port ENET.E_TXD7
NetU100_L13: U100.L13(IO_L40N_GCLK10_M1A6_1) ; port ENET.E_TXER
NetU100_L15: U100.L15(IO_L42P_GCLK7_M1UDM_1) ; port ENET.E_MDC
NetU100_L16: U100.L16(IO_L42N_GCLK6_TRDY1_M1LDM_1) ; port ENET.E_MDIO
NetU100_M1: U100.M1(IO_L36N_M3DQ9_3) ; port DDR3.DDR3_DQ9
NetU100_M3: U100.M3(IO_L36P_M3DQ8_3) ; port DDR3.DDR3_DQ8
NetU100_N1: U100.N1(IO_L35N_M3DQ11_3) ; port DDR3.DDR3_DQ11
NetU100_N2: U100.N2(IO_L35P_M3DQ10_3) ; port DDR3.DDR3_DQ10
NetU100_P1: U100.P1(IO_L34N_M3UDQSN_3) ; port DDR3.DDR3_UDQS_N
NetU100_P2: U100.P2(IO_L34P_M3UDQS_3) ; port DDR3.DDR3_UDQS_P
NetU100_R13: U100.R13(IO_L3P_D0_DIN_MISO_MISO1_2) ; port FLASH.QSPI_MISO1
NetU100_T1: U100.T1(IO_L33N_M3DQ13_3) ; port DDR3.DDR3_DQ13
NetU100_T2: U100.T2(IO_L33P_M3DQ12_3) ; port DDR3.DDR3_DQ12
NetU100_T13: U100.T13(IO_L3N_MOSI_CSI_B_MISO0_2) ; port FLASH.QSPI_MISO0
NetU100_T14: U100.T14(IO_L12P_D1_MISO2_2) ; port FLASH.QSPI_MISO2
NetU100_U1: U100.U1(IO_L32N_M3DQ15_3) ; port DDR3.DDR3_DQ15
NetU100_U2: U100.U2(IO_L32P_M3DQ14_3) ; port DDR3.DDR3_DQ14
NetU100_U15: U100.U15(IO_L5P_2) ; port FLASH.QSPI_CS
NetU100_U16: U100.U16(IO_L2P_CMPCLK_2) ; port 24C02.EEPROM_SCL
NetU100_V14: U100.V14(IO_L12N_D2_MISO3_2) ; port FLASH.QSPI_MISO3
NetU100_V15: U100.V15(IO_L5N_2) ; port FLASH.QSPI_CLK
NetU100_V16: U100.V16(IO_L2N_CMPMOSI_2) ; port 24C02.EEPROM_SDA

Not connected (* = marked no-connect by the designer): JTAG 12*; U100 A12(IO_L41N_0)* C4(IO_L1N_VREF_0)* C12(IO_L47N_0)* C17(IO_L29P_A23_M1A13_1)* C18(IO_L29N_A22_M1A14_1)* D12(IO_L47P_0)* E6(IO_L7N_0)* E7(IO_L9P_0)* E8(IO_L9N_0)* E11(IO_L42N_0)* E13(IO_L63N_SCP6_0)* F7(IO_L7P_0)* F8(IO_L32N_0)* F10(IO_L40N_0)* F11(IO_L42P_0)* F14(IO_L30P_A21_M1RESET_1)* F15(IO_L1P_A25_1)* F16(IO_L1N_A24_VREF_1)* G8(IO_L32P_0)* G11(IO_L40P_0)* H17(IO_L43P_GCLK5_M1DQ4_1)* H18(IO_L43N_GCLK4_M1DQ5_1)* K18(IO_L45N_A0_M1LDQSN_1)* L6(IO_L31P_3)* L17(IO_L46P_FCS_B_M1DQ2_1)* M8(IO_L40P_2)* M16(IO_L47P_FWE_B_M1DQ0_1)* N4(IO_L1P_3)* P4(IO_L2P_3)* P12(IO_L13N_D10_2)* T8(IO_L31N_GCLK30_D15_2)* T9(IO_L32P_GCLK29_2)* V2(PROGRAM_B_2)* V17(DONE_2)*

## Layout directives
rule Matched Net Lengths [Tolerance = 100mil]; net class JTAG: FPGA_TCK, FPGA_TDI, FPGA_TDO, FPGA_TMS

## Notes on the sheet
- XC6SLX16_45 FPGA PART
- (near U100) ADC使用的是并行接口，普通IO即可
- ADC使用的是并行接口，普通IO即可
- (near U100) 使用的是SPI*1速度较低，用普通IO
- DDR3的数据线必须连接到FPGA的引脚名带有DQ的pin；
  DDR3的DQS线必须连接到FPGA的引脚名带有DQS的pin；
  DDR3的地址线连接到FPGA的普通I/O引脚；
  DDR3的DM信号连接到FPGA的引脚名带有DM的pin；
  DDR3的时钟信号要接到FPGA钟的CLK以及CLKN差分时钟信号输出脚
- 使用的是SPI*4
- (near R102) IIC使用普通IO
- USB的时钟需要接到CLK脚 数据线要接到普通IO
- JTAG
- RCC
- 1713304422
- 廖哲霖
- Title
- Size:
- Date:
- File:
- A1
- Number:
- Time:
- Revision:
- Sheet
- of
- (in symbol XC6SLX16_45, part A) Spartan 6; Bank 0; (Part 1 of 8)
- (in symbol XC6SLX16_45, part B) Spartan 6; Bank 1; (Part 2 of 8)
- (in symbol XC6SLX16_45, part C) Spartan 6; Bank 2; (Part 3 of 8)
- (in symbol XC6SLX16_45, part D) Spartan 6; Bank 3; (Part 4 of 8)
- (in symbol XC6SLX16_45, part E) Spartan 6; (Part 5 of 8)
- (in symbol XC6SLX16_45, part F) Spartan 6; (Part 6 of 8)
- (in symbol XC6SLX16_45, part G) Spartan 6; (Part 7 of 8)
- (in symbol XC6SLX16_45, part H) Spartan 6; Config; (Part 8 of 8)

## Library data of the parts
C100-C138 = C: 无极性贴片电容; 版权归属: 源创客; BOM名称: 无极性贴片电容; 学习资源: www.ooocke.com
JTAG = Header  6X2: 6*2P接插件; 版权归属: 源创客; BOM名称: 6*2P接插件; 学习资源: www.ooocke.com
M1-M4 = M3: 铜柱孔; 版权归属: 源创客; BOM名称: 铜柱孔; 学习资源: www.ooocke.com
R100-R112 = R: 贴片电阻; 版权归属: 源创客; BOM名称: 贴片电阻; 学习资源: www.ooocke.com
S100 = S1: 版权归属: 源创客; BOM名称: 散热片; 学习资源: www.ooocke.com